# Altium project ESP32_IO_module.PrjPcb
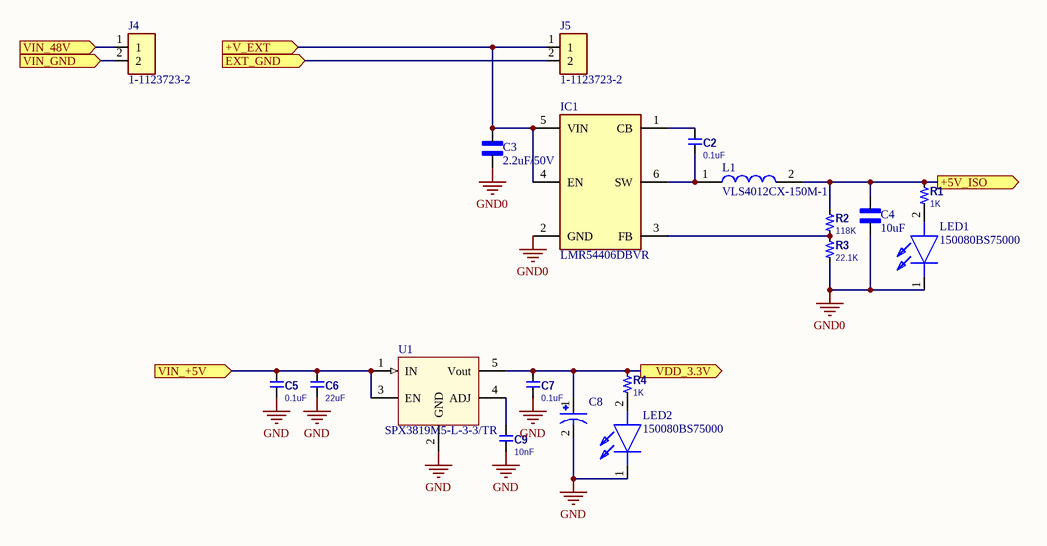
[diagram p0: Power_management.SchDoc]
6 sheets, 149 parts. Net scope: flat (ports and power ports of the same name join across sheets).
Board file: PCB1.PcbDoc
Sheets:
  Power_management.SchDoc
  MCU.SchDoc
  DIGITAL_INPUT.SchDoc
  ANALOG_INPUT.SchDoc
  DIGITAL_OUTPUT.SchDoc
  RFID.SchDoc

## Sheet Power_management.SchDoc
size A

### Parts
C2  0.1uF  [0603-C]
C3  2.2uF/50V  [0805_C]
C4  10uF  [0805_C]
C5  0.1uF  [0603-C]
C6  22uF  [0603-C]
C7  0.1uF  [0603-C]
C8  T493X227K010BH6420_220uF  [CAPPM7343X430N]  (value not drawn)
C9  10nF  [0603-C]
IC1  LMR54406DBVR  [SOT95P280X145-6N]
J4  1-1123723-2  [TE_1-1123723-2]
J5  1-1123723-2  [TE_1-1123723-2]
L1  VLS4012CX-150M-1  [VLS4012]
LED1  150080BS75000  [LEDC2012X80N]
LED2  150080BS75000  [LEDC2012X80N]
R1  1K  [0603-R]
R2  118K  [0603-R]
R3  22.1K  [0603-R]
R4  1K  [0603-R]
U1  SPX3819M5-L-3-3/TR  [SOT23-5]

### Ports
+5V_ISO (out), +V_EXT (in), EXT_GND (in), VDD_3.3V (out), VIN_48V (in), VIN_+5V (in), VIN_GND (in)

### Nets
GND: C5.2 C6.2 C7.2 C8.2 C9.2 LED2.1(K) U1.2(GND)
GND0: C3.2 C4.2 IC1.2(GND) LED1.1(K) R3.1
NetC2_1: C2.1 IC1.1(CB)
NetC2_2: C2.2 IC1.6(SW) L1.1
NetC3_1: C3.1 IC1.4(EN) IC1.5(VIN) J5.1 ; port +V_EXT
NetC4_1: C4.1 L1.2 R1.2 R2.2 ; port +5V_ISO
NetC5_1: C5.1 C6.1 U1.1(IN) U1.3(EN) ; port VIN_+5V
NetC7_1: C7.1 C8.1 R4.2 U1.5(Vout) ; port VDD_3.3V
NetC9_1: C9.1 U1.4(ADJ)
NetIC1_3: IC1.3(FB) R2.1 R3.2
NetJ4_1: J4.1 ; port VIN_48V
NetJ4_2: J4.2 ; port VIN_GND
NetJ5_2: J5.2 ; port EXT_GND
NetLED1_2: LED1.2(A) R1.1
NetLED2_2: LED2.2(A) R4.1

### Library data of the parts
C2 C5-C7 C9 = CAP: Manufacturer: TDK EPCOS; Manufacturer Part Number: B37941K9105K62; Capacitance: 1uF; Voltage Rating: 16V; Tolerance: 10%; ComponentLink1URL: https://datasheet.ciiva.com/13389/upy-gphc-y5v-6-3v-to-50v-5-13389978.pdf?src-supplier=Mouser; ComponentLink1Description: Datasheet; Supplier 1: Digi-Key; RoHS: Yes; Category: Ceramic Capacitors; Mount: Surface Mount; Case/Package: 0805; Case Code (Metric): 2012; Case Code (Imperial): 0805; Min Operating Temperature: -55°C; Max Operating Temperature: 125°C; Package Quantity: 3000; Packaging: Tape and Reel; Voltage Rating (DC): 16V; Length: 0.079inch; Width: 0.049inch; Height: 1.35mm; Thickness: 0.049inch; Ratings: AEC-Q200; Lead Free: Lead Free; ComponentLink2URL: http://components.arrow.com/part/dataview/0323_01879911?src-supplier=Arrow+Europe; ComponentLink2Description: http://components.arrow.com/part/dataview/0323_01879911?src-supplier=Arrow+Europe; ComponentLink3URL: https://media.digikey.com/pdf/Data%20Sheets/Epcos%20PDFs/B37872K_B37941K_Series.pdf?src-supplier=Digi-Key; ComponentLink3Description: https://media.digikey.com/pdf/Data%20Sheets/Epcos%20PDFs/B37872K_B37941K_Series.pdf?src-supplier=Digi-Key; Supplier Part Number 1: 495-1935-1-ND
C3 C4 = CAP: MP: LD03ZD475MAB2A; Package: None; Price: None; Value: *; Availability: Unavailable
C8 = T493X227K010BH6420_220uF: MF: Kemet; Value: *; MP: T493X227K010BH6420; Package: SMD-2 Kemet; Availability: In Stock; Check_prices: https://www.snapeda.com/parts/T493X227K010BH6420/Kemet/view-part/?ref=eda; SnapEDA_Link: https://www.snapeda.com/parts/T493X227K010BH6420/Kemet/view-part/?ref=snap; Price: None
IC1 = LMR54406DBVR: Integrated Circuit; Manufacturer_Name: Texas Instruments; Datasheet Link: https://www.ti.com/lit/ds/symlink/lmr54406.pdf?ts=1659688249350&ref_url=https%253A%252F%252Fwww.ti.com%252Fproduct%252FLMR54406%252Fpart-details%252FLMR54406DBVR; Height: 1.45mm; Manufacturer_Part_Number: LMR54406DBVR; Mouser Part Number: 595-LMR54406DBVR; Mouser Price/Stock: https://www.mouser.co.uk/ProductDetail/Texas-Instruments/LMR54406DBVR?qs=rSMjJ%252B1ewcQLNU8KVBwgHQ%3D%3D; Arrow Part Number: LMR54406DBVR; Arrow Price/Stock: https://www.arrow.com/en/products/lmr54406dbvr/texas-instruments?region=nac
J4 J5 = 1-1123723-2: 3.96 EP HDR ASSY 2P_NATURAL_; Number_of_Positions: 2; MF: TE Connectivity; Product_Type: Header; Centerline_Pitch: 3.96 mm[.156 in]; EU_RoHS_Compliance: Compliant; Value: *; TE_purchase_URL: https://www.te.com/usa-en/product-1-1123723-2.html?te_bu=Cor&te_type=disp&te_campaign=seda_glo_cor-seda-global-disp-prtnr-fy19-seda-model-bom-cta_sma-317_1&elqCampaignId=32493; SnapEDA_Link: https://www.snapeda.com/parts/1-1123723-2/TE%20Connectivity%20AMP%20Connectors/view-part/231687/?ref=snap; Package: None; MP: 1-1123723-2; Digi-Key_Purchase_URL: https://www.digikey.com/product-detail/en/te-connectivity-amp-connectors/1-1123723-2/A111830-ND/686925?utm_source=snapeda&utm_medium=aggregator&utm_campaign=symbol; Digi-Key_Part_Number: A111830-ND
L1 = VLS4012CX-150M-1: Inductor; Manufacturer_Name: TDK; Datasheet Link: https://product.tdk.com/system/files/dam/doc/product/inductor/inductor/smd/catalog/inductor_commercial_power_vls4012cx-1_en.pdf; Manufacturer_Part_Number: VLS4012CX-150M-1; Mouser Part Number: 810-VLS4012CX150M1; Mouser Price/Stock: https://www.mouser.co.uk/ProductDetail/TDK/VLS4012CX-150M-1?qs=sPbYRqrBIVl6JuB3PiTP7w%3D%3D
LED1 LED2 = 150080BS75000: LED; Manufacturer_Name: Wurth Elektronik; Datasheet Link: https://katalog.we-online.com/led/datasheet/150080BS75000.pdf; Height: 0.8mm; Manufacturer_Part_Number: 150080BS75000; Mouser Part Number: 710-150080BS75000; Mouser Price/Stock: https://www.mouser.co.uk/ProductDetail/Wurth-Elektronik/150080BS75000?qs=2kOmHSv6VfT2tBo3UPVqAQ%3D%3D
R1-R4 = Res_2: Manufacturer: Panasonic; Manufacturer Part Number: ERJ-8GEYJ621V; Resistance: 620R; Tolerance: 5%; Voltage Rating: 200V; Temperature Coefficient: 200ppm/°C; Max Power Dissipation: 250mW; ComponentLink1URL: https://datasheet.ciiva.com/15193/getdatasheetpartid-366470-15193725.pdf?src-supplier=Verical; ComponentLink1Description: Datasheet; Supplier 1: Avnet; Stock 1: 6255; Pricing 1: 1 = 0.01200 (USD); RoHS: Yes; Mount: Surface Mount; Case Code (Metric): 3216; Case Code (Imperial): 1206; Contact Plating: Tin; Min Operating Temperature: -55°C; Max Operating Temperature: 155°C; Packaging: Tape and Reel; Package Quantity: 1; Resistor Type: Thick Film; Number of Terminations: 2; Voltage Rating (DC): 200V; Features: Automotive AEC-Q200; Series: ERJ; Construction: Rectangular; Resistance Tolerance: 5%; Length: 3.2mm; Width: 0.063inch; Height: 0.028inch; Depth: 1.6mm; Radiation Hardening: No; REACH SVHC: No SVHC; Military Standard: Not; Lead Free: Lead Free; RoHS Compliant: Yes; ComponentLink2URL: https://datasheet.ciiva.com/46387/1500035-46387094.pdf?src-supplier=Element14; ComponentLink2Description: https://datasheet.ciiva.com/46387/1500035-46387094.pdf?src-supplier=Element14; ComponentLink3URL: https://datasheet.ciiva.com/5915/1500035-5915369.pdf?src-supplier=Farnell; ComponentLink3Description: https://datasheet.ciiva.com/5915/1500035-5915369.pdf?src-supplier=Farnell; ComponentLink4URL: https://datasheet.ciiva.com/28677/1678796-28677018.pdf?src-supplier=Element14; ComponentLink4Description: https://datasheet.ciiva.com/28677/1678796-28677018.pdf?src-supplier=Element14; ComponentLink5URL: https://datasheet.ciiva.com/17204/aoa0000ce1-17204972.pdf?src-supplier=Avnet+Europe; ComponentLink5Description: https://datasheet.ciiva.com/17204/aoa0000ce1-17204972.pdf?src-supplier=Avnet+Europe; ComponentLink6URL: https://datasheet.ciiva.com/16515/aoa0000ce1-16515933.pdf?src-supplier=Avnet+Asia; ComponentLink6Description: https://datasheet.ciiva.com/16515/aoa0000ce1-16515933.pdf?src-supplier=Avnet+Asia; Supplier Part Number 1: 65T8955; Power Rating: 250mW; Case/Package: 0603
U1 = SPX3819: Linear Voltage Regulator IC 1 Output 500mA SOT-23-5; MF: MaxLinear, Inc.; SnapEDA_Link: https://www.snapeda.com/parts/SPX3819/MaxLinear,%20Inc./view-part/885098/?ref=snap; Package: SOT-23-5 MaxLinear, Inc.; Availability: Unavailable; Price: None; MP: SPX3819; Value: *

## Sheet MCU.SchDoc: MCU
size A3; DocumentNumber: MB1136; Revision: C.3; SheetNumber: 2; SheetTotal: 4; Project: NUCLEO-XXXXRX
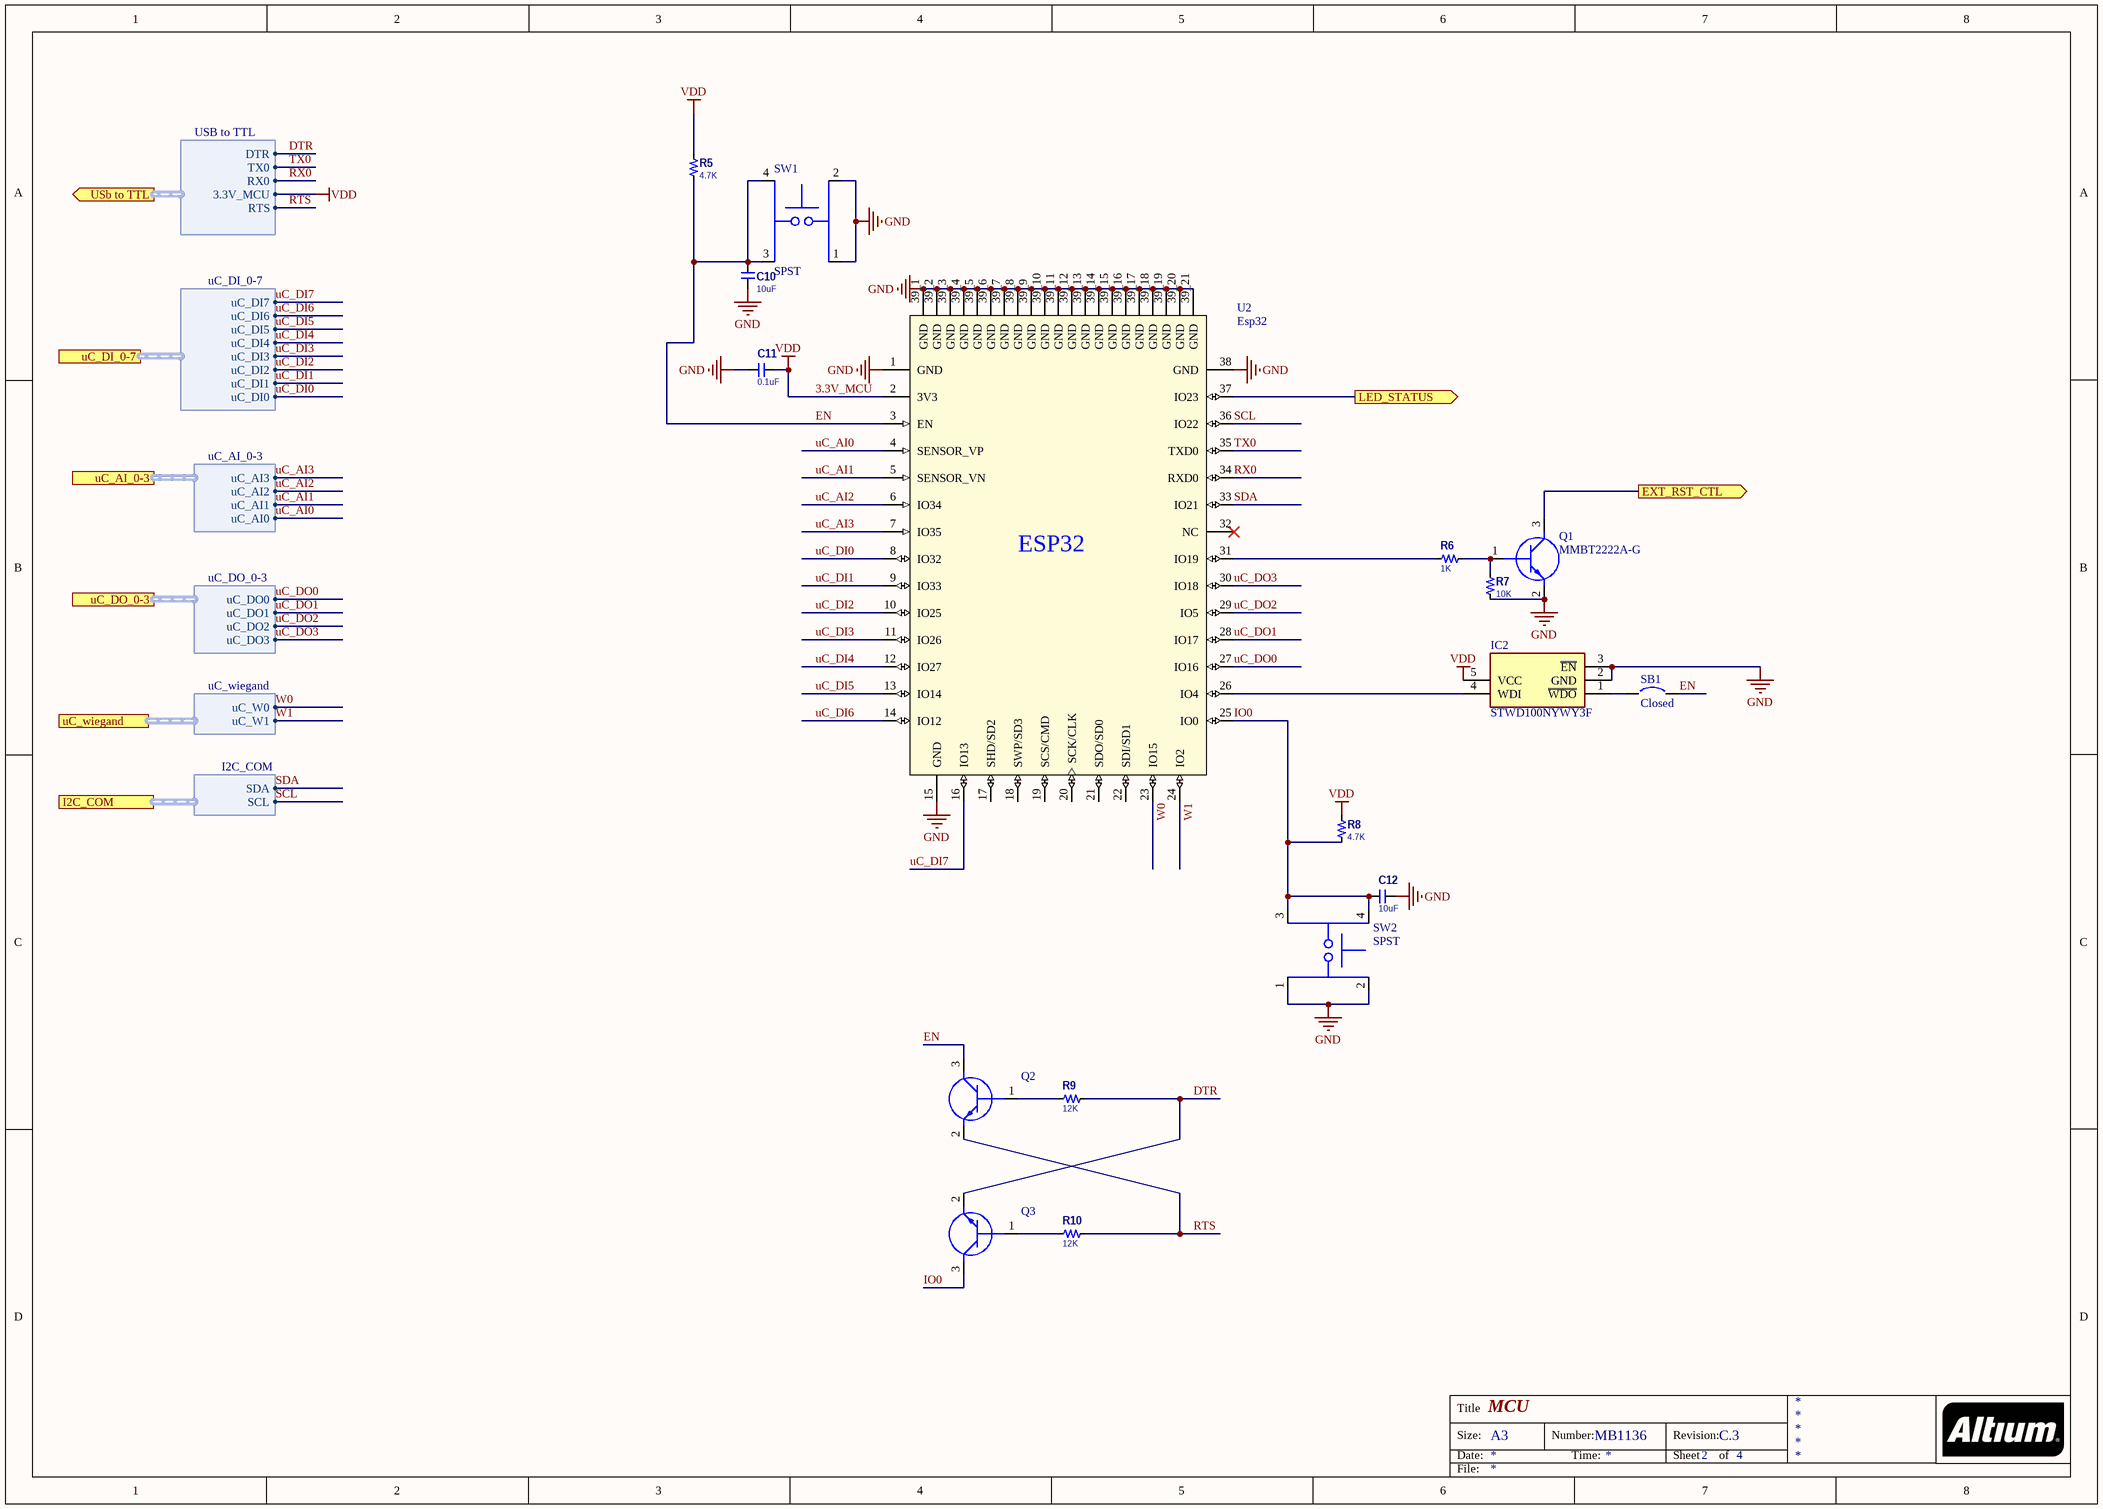
[diagram p1: MCU.SchDoc]

### Parts
C10  10uF  [0603-C]
C11  0.1uF  [0603-C]
C12  10uF  [0603-C]
IC2  STWD100NYWY3F  [SOT95P280X145-5N]
Q1  MMBT2222A-G  [SOT95P240X115-3N]
Q2  MMBT2222A-G  [SOT95P240X115-3N]  (value not drawn)
Q3  MMBT2222A-G  [SOT95P240X115-3N]  (value not drawn)
R5  4.7K  [0603-R]
R6  1K  [0603-R]
R7  10K  [0603-R]
R8  4.7K  [0603-R]
R9  12K  [0603-R]
R10  12K  [0603-R]
SB1  Closed  [SB_0603]
SW1  SPST  [TL3342F160QG]
SW2  SPST  [TL3342F160QG]
U2  Esp32  [MODULE_ESP32-WROOM-32]

### Ports
EXT_RST_CTL (out), I2C_COM (harness I2C_COM), LED_STATUS (out), uC_AI_0-3 (harness uC_AI_0-3), uC_DI_0-7 (harness uC_DI_0-7), uC_DO_0-3 (harness uC_DO_0-3), uC_wiegand (harness uC_wiegand), USb to TTL (out, harness USB to TTL)

### Harnesses
USB to TTL: TX0, RX0, DTR, RTS, 3.3V_MCU
uC_DI_0-7: uC_DI0, uC_DI1, uC_DI2, uC_DI3, uC_DI4, uC_DI5, uC_DI6, uC_DI7
uC_AI_0-3: uC_AI0, uC_AI1, uC_AI2, uC_AI3
uC_DO_0-3: uC_DO0, uC_DO1, uC_DO2, uC_DO3
uC_wiegand: uC_W0, uC_W1
I2C_COM: SDA, SCL

### Nets
3.3V_MCU: C11.2 IC2.5(VCC) R5.2 R8.2 U2.2(3V3) ; port USb to TTL.3.3V_MCU  [also labelled VDD]
GND: C10.2 C11.1 C12.2 IC2.2(GND) IC2.3(~{EN}) Q1.2(E) R7.1 SW1.1 SW1.2 SW2.1 SW2.2 U2.1(GND) U2.15(GND) U2.38(GND) U2.39_1(GND) U2.39_2(GND) U2.39_3(GND) U2.39_4(GND) U2.39_5(GND) U2.39_6(GND) U2.39_7(GND) U2.39_8(GND) U2.39_9(GND) U2.39_10(GND) U2.39_11(GND) U2.39_12(GND) U2.39_13(GND) U2.39_14(GND) U2.39_15(GND) U2.39_16(GND) U2.39_17(GND) U2.39_18(GND) U2.39_19(GND) U2.39_20(GND) U2.39_21(GND)
DTR: Q3.2(E) R9.1 ; port USb to TTL.DTR
EN: C10.1 Q2.3(C) R5.1 SB1.2 SW1.3 SW1.4 U2.3(EN)
IO0: C12.1 Q3.3(C) R8.1 SW2.3 SW2.4 U2.25(IO0)
RTS: Q2.2(E) R10.1 ; port USb to TTL.RTS
RX0: U2.34(RXD0) ; port USb to TTL.RX0
SCL: U2.36(IO22) ; port I2C_COM.SCL
SDA: U2.33(IO21) ; port I2C_COM.SDA
TX0: U2.35(TXD0) ; port USb to TTL.TX0
uC_AI0: U2.4(SENSOR_VP) ; port uC_AI_0-3.uC_AI0
uC_AI1: U2.5(SENSOR_VN) ; port uC_AI_0-3.uC_AI1
uC_AI2: U2.6(IO34) ; port uC_AI_0-3.uC_AI2
uC_AI3: U2.7(IO35) ; port uC_AI_0-3.uC_AI3
uC_DI0: U2.8(IO32) ; port uC_DI_0-7.uC_DI0
uC_DI1: U2.9(IO33) ; port uC_DI_0-7.uC_DI1
uC_DI2: U2.10(IO25) ; port uC_DI_0-7.uC_DI2
uC_DI3: U2.11(IO26) ; port uC_DI_0-7.uC_DI3
uC_DI4: U2.12(IO27) ; port uC_DI_0-7.uC_DI4
uC_DI5: U2.13(IO14) ; port uC_DI_0-7.uC_DI5
uC_DI6: U2.14(IO12) ; port uC_DI_0-7.uC_DI6
uC_DI7: U2.16(IO13) ; port uC_DI_0-7.uC_DI7
uC_DO0: U2.27(IO16) ; port uC_DO_0-3.uC_DO0
uC_DO1: U2.28(IO17) ; port uC_DO_0-3.uC_DO1
uC_DO2: U2.29(IO5) ; port uC_DO_0-3.uC_DO2
uC_DO3: U2.30(IO18) ; port uC_DO_0-3.uC_DO3
W0: U2.23(IO15) ; port uC_wiegand.uC_W0
W1: U2.24(IO2) ; port uC_wiegand.uC_W1
NetIC2_1: IC2.1(~{WDO}) SB1.1
NetIC2_4: IC2.4(WDI) U2.26(IO4)
NetQ1_1: Q1.1(B) R6.1 R7.2
NetQ1_3: Q1.3(C) ; port EXT_RST_CTL
NetQ2_1: Q2.1(B) R9.2
NetQ3_1: Q3.1(B) R10.2
NetR6_2: R6.2 U2.31(IO19)
NetU2_37: U2.37(IO23) ; port LED_STATUS

Not connected (* = marked no-connect by the designer): U2 17(SHD/SD2) 18(SWP/SD3) 19(SCS/CMD) 20(SCK/CLK) 21(SDO/SD0) 22(SDI/SD1) 32(NC)*

### Notes on the sheet
- Title
- Size:
- Date:
- A3
- Number:
- Time:
- Revision:
- Sheet
- of
- File:
- (in symbol ESP32-WROOM-32) ESP32

### Library data of the parts
C10-C12 = CAP: as C2 on sheet Power_management; ComponentLink1URL: https://datasheet.ciiva.com/13389/upy-gphc-y5v-6-3v-to-50v-5-13389978.pdf?src-supplier=Mouser; ComponentLink1Description: Datasheet; Supplier 1: Digi-Key; RoHS: Yes; Category: Ceramic Capacitors; Mount: Surface Mount; Case/Package: 0805; Case Code (Metric): 2012; Case Code (Imperial): 0805; Min Operating Temperature: -55°C; Max Operating Temperature: 125°C; Package Quantity: 3000; Packaging: Tape and Reel; Voltage Rating (DC): 16V; Length: 0.079inch; Width: 0.049inch; Height: 1.35mm; Thickness: 0.049inch; Ratings: AEC-Q200; Lead Free: Lead Free; ComponentLink2URL: http://components.arrow.com/part/dataview/0323_01879911?src-supplier=Arrow+Europe; ComponentLink2Description: http://components.arrow.com/part/dataview/0323_01879911?src-supplier=Arrow+Europe; ComponentLink3URL: https://media.digikey.com/pdf/Data%20Sheets/Epcos%20PDFs/B37872K_B37941K_Series.pdf?src-supplier=Digi-Key; ComponentLink3Description: https://media.digikey.com/pdf/Data%20Sheets/Epcos%20PDFs/B37872K_B37941K_Series.pdf?src-supplier=Digi-Key; Supplier Part Number 1: 495-1935-1-ND
IC2 = STWD100NYWY3F: Integrated Circuit; Manufacturer_Name: STMicroelectronics; Datasheet Link: https://datasheet.datasheetarchive.com/originals/distributors/Datasheets-DGA25/1683135.pdf; Height: 1.45mm; Manufacturer_Part_Number: STWD100NYWY3F; Mouser Part Number: 511-STWD100NYWY3F; Mouser Price/Stock: https://www.mouser.co.uk/ProductDetail/STMicroelectronics/STWD100NYWY3F?qs=jWm4idrLpzx15dHtESXwMQ%3D%3D; Arrow Part Number: STWD100NYWY3F; Arrow Price/Stock: https://www.arrow.com/en/products/stwd100nywy3f/stmicroelectronics?region=europe
Q1 Q3 = MMBT2222A-G: Transistor BJT NPN; Manufacturer_Name: Comchip Technology; Height: 1.15mm; Manufacturer_Part_Number: MMBT2222A-G; Mouser Part Number: 750-MMBT2222A-G; Mouser Price/Stock: https://www.mouser.co.uk/ProductDetail/Comchip-Technology/MMBT2222A-G?qs=2qJf6qQ4IOIM%2FSE9iCL8gQ%3D%3D; Arrow Part Number: MMBT2222A-G
  Q1: Datasheet Link: https://datasheet.datasheetarchive.com/originals/distributors/Datasheets-7/DSA-138996.pdf; Arrow Price/Stock: https://www.arrow.com/en/products/mmbt2222a-g/comchip-technology?region=nac
  Q3: Datasheet Link: http://www.comchiptech.com/admin/files/product/MMBT2222A-G%20RevB.pdf; Arrow Price/Stock: https://www.arrow.com/en/products/mmbt2222a-g/comchip-technology
Q2 = MMBT2222A-G_Mirror: Transistor BJT NPN; Manufacturer_Name: Comchip Technology; Datasheet Link: http://www.comchiptech.com/admin/files/product/MMBT2222A-G%20RevB.pdf; Height: 1.15mm; Manufacturer_Part_Number: MMBT2222A-G; Mouser Part Number: 750-MMBT2222A-G; Mouser Price/Stock: https://www.mouser.co.uk/ProductDetail/Comchip-Technology/MMBT2222A-G?qs=2qJf6qQ4IOIM%2FSE9iCL8gQ%3D%3D; Arrow Part Number: MMBT2222A-G; Arrow Price/Stock: https://www.arrow.com/en/products/mmbt2222a-g/comchip-technology
R5-R10 = Res_2: as R1 on sheet Power_management; ComponentLink1URL: https://datasheet.ciiva.com/15193/getdatasheetpartid-366470-15193725.pdf?src-supplier=Verical; ComponentLink1Description: Datasheet; Supplier 1: Avnet; Stock 1: 6255; Pricing 1: 1 = 0.01200 (USD); RoHS: Yes; Mount: Surface Mount; Case Code (Metric): 3216; Case Code (Imperial): 1206; Contact Plating: Tin; Min Operating Temperature: -55°C; Max Operating Temperature: 155°C; Packaging: Tape and Reel; Package Quantity: 1; Resistor Type: Thick Film; Number of Terminations: 2; Voltage Rating (DC): 200V; Features: Automotive AEC-Q200; Series: ERJ; Construction: Rectangular; Resistance Tolerance: 5%; Length: 3.2mm; Width: 0.063inch; Height: 0.028inch; Depth: 1.6mm; Radiation Hardening: No; REACH SVHC: No SVHC; Military Standard: Not; Lead Free: Lead Free; RoHS Compliant: Yes; ComponentLink2URL: https://datasheet.ciiva.com/46387/1500035-46387094.pdf?src-supplier=Element14; ComponentLink2Description: https://datasheet.ciiva.com/46387/1500035-46387094.pdf?src-supplier=Element14; ComponentLink3URL: https://datasheet.ciiva.com/5915/1500035-5915369.pdf?src-supplier=Farnell; ComponentLink3Description: https://datasheet.ciiva.com/5915/1500035-5915369.pdf?src-supplier=Farnell; ComponentLink4URL: https://datasheet.ciiva.com/28677/1678796-28677018.pdf?src-supplier=Element14; ComponentLink4Description: https://datasheet.ciiva.com/28677/1678796-28677018.pdf?src-supplier=Element14; ComponentLink5URL: https://datasheet.ciiva.com/17204/aoa0000ce1-17204972.pdf?src-supplier=Avnet+Europe; ComponentLink5Description: https://datasheet.ciiva.com/17204/aoa0000ce1-17204972.pdf?src-supplier=Avnet+Europe; ComponentLink6URL: https://datasheet.ciiva.com/16515/aoa0000ce1-16515933.pdf?src-supplier=Avnet+Asia; ComponentLink6Description: https://datasheet.ciiva.com/16515/aoa0000ce1-16515933.pdf?src-supplier=Avnet+Asia; Supplier Part Number 1: 65T8955; Power Rating: 250mW; Case/Package: 0603
SB1 = Circuit Breaker_close: Circuit Breaker; Published: 24-Mar-1999; Revision: July-2002: Re-released for DXP Platform.; Publisher: Altium Limited
SW1 SW2 = SWITCH TACTILE SPST-NO 0.05A 12V_EWP: E-SWITCH - TL3342F160QG - SWITCH, TACTILE, SPST-NO, 50mA, 12VDC; Manufacturer: SOFNG; Manufacturer Part Number: TS-1187-1816; Actuator Material: Polyphenylene; Mechanical Life: 100000Cycles; Switch Function: Off-Mom; Actuator Type: Standard; Illumination Type: Non-Illuminated; Operating Force: 160gf; Voltage Rating (DC): 12V; Actuator Length: 0.3mm; Supplier 1: Digi-Key; RoHS: Yes; Category: Tactile Switches; Stock 1: 9379; Pricing 1: 1=0.66000, 10=0.63500, 25=0.61120, 100=0.53040, 250=0.48396, 500=0.44974, 1000=0.40329 (USD); Mount: Surface Mount; Contact Plating: Silver; Contact Material: Silver; Throw Configuration: SPST; Packaging: Tape and Reel; Termination: Gull Wing; Current Rating: 50mA; Package Quantity: 3000; Series: TL3342; Orientation: Straight; Electrical Life: 100000Cycles; Max Voltage Rating (DC): 12V; Size: 5.2mm; RoHS Compliant: Yes; ComponentLink1URL: https://datasheet.lcsc.com/lcsc/1809012111_SOFNG-TS-1187-1816_C183614.pdf; ComponentLink1Description: https://datasheet.ciiva.com/2900/tl3342-2900822.pdf?src-supplier=Digi-Key; Supplier Part Number 1: EG2531CT-ND
U2 = ESP32-WROOM-32: Bluetooth, WiFi Transceiver Module 2.4GHz ~ 2.5GHz Surface Mount; MF: Espressif Systems; Package: Module Espressif Systems; Digi-Key_Part_Number: 1904-1010-1-ND; Digi-Key_Purchase_URL: https://www.digikey.com/product-detail/en/espressif-systems/ESP32-WROOM-32/1904-1010-1-ND/8544305?utm_source=snapeda&utm_medium=aggregator&utm_campaign=symbol; Value: *; MP: ESP32-WROOM-32; SnapEDA_Link: https://www.snapeda.com/parts/ESP32-WROOM-32/Espressif%20Systems/view-part/2753322/?ref=snap

## Sheet DIGITAL_INPUT.SchDoc
size A
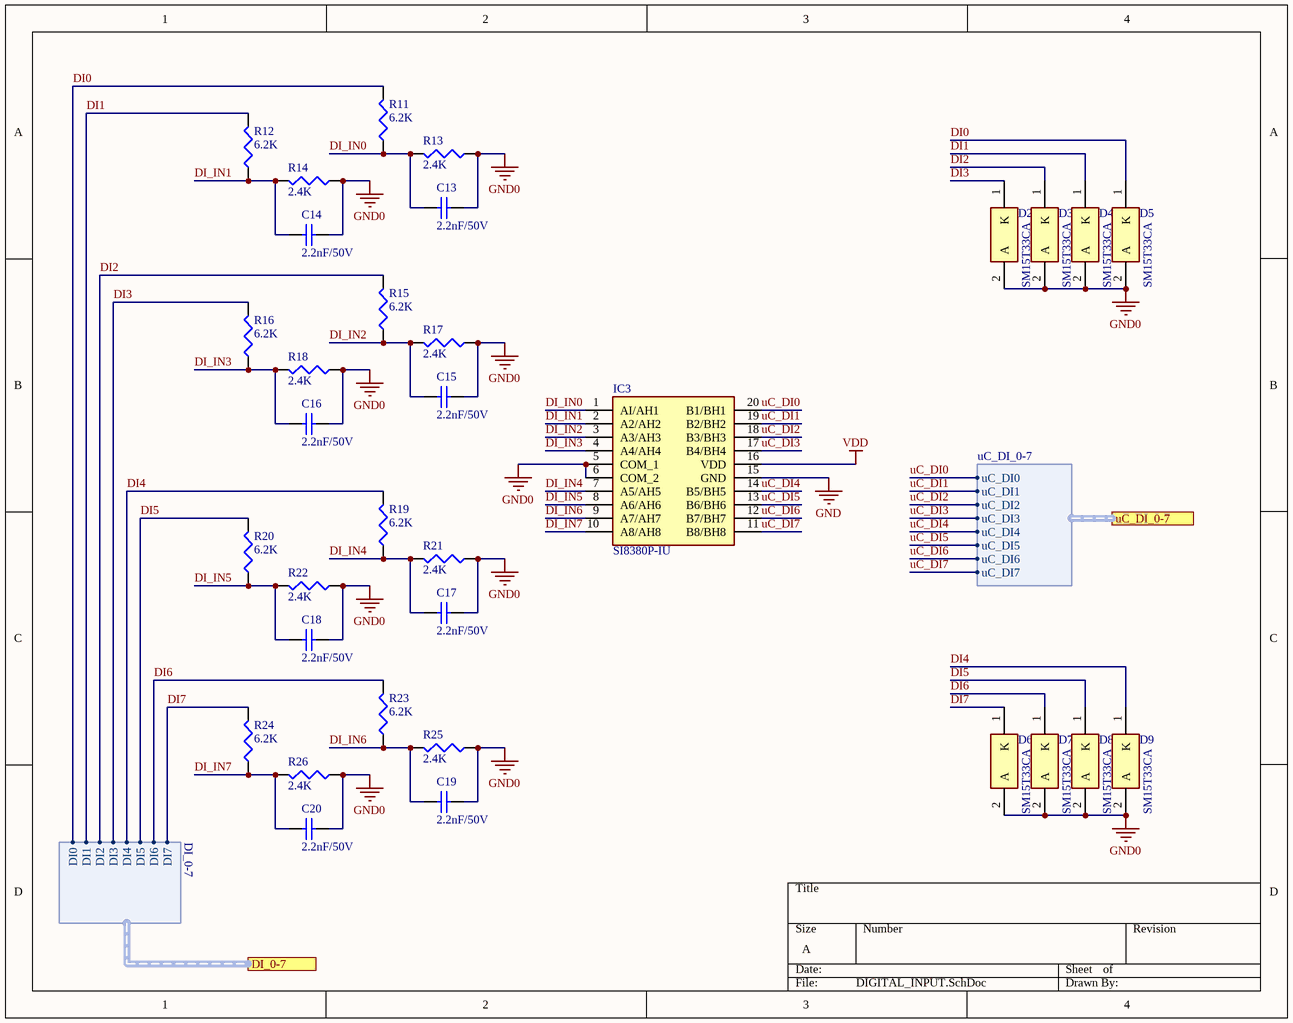
[diagram p2: DIGITAL_INPUT.SchDoc]

### Parts
C13  2.2nF/50V  [C1210]
C14  2.2nF/50V  [C1210]
C15  2.2nF/50V  [C1210]
C16  2.2nF/50V  [C1210]
C17  2.2nF/50V  [C1210]
C18  2.2nF/50V  [C1210]
C19  2.2nF/50V  [C1210]
C20  2.2nF/50V  [C1210]
D2  SM15T33CA  [DIONM8059X265N]
D3  SM15T33CA  [DIONM8059X265N]
D4  SM15T33CA  [DIONM8059X265N]
D5  SM15T33CA  [DIONM8059X265N]
D6  SM15T33CA  [DIONM8059X265N]
D7  SM15T33CA  [DIONM8059X265N]
D8  SM15T33CA  [DIONM8059X265N]
D9  SM15T33CA  [DIONM8059X265N]
IC3  SI8380P-IU  [SOP64P600X175-20N]
R11  6.2K  [12Z-2010]
R12  6.2K  [12Z-2010]
R13  2.4K  [12Z-2010]
R14  2.4K  [12Z-2010]
R15  6.2K  [12Z-2010]
R16  6.2K  [12Z-2010]
R17  2.4K  [12Z-2010]
R18  2.4K  [12Z-2010]
R19  6.2K  [12Z-2010]
R20  6.2K  [12Z-2010]
R21  2.4K  [12Z-2010]
R22  2.4K  [12Z-2010]
R23  6.2K  [12Z-2010]
R24  6.2K  [12Z-2010]
R25  2.4K  [12Z-2010]
R26  2.4K  [12Z-2010]

### Ports
DI_0-7 (harness DI_0-7), uC_DI_0-7 (harness uC_DI_0-7)

### Harnesses
DI_0-7: DI0, DI1, DI2, DI3, DI4, DI5, DI6, DI7
uC_DI_0-7: uC_DI0, uC_DI1, uC_DI2, uC_DI3, uC_DI4, uC_DI5, uC_DI6, uC_DI7

### Nets
GND: IC3.15(GND)
GND0: C13.2 C14.2 C15.2 C16.2 C17.2 C18.2 C19.2 C20.2 D2.2(A) D3.2(A) D4.2(A) D5.2(A) D6.2(A) D7.2(A) D8.2(A) D9.2(A) IC3.5(COM_1) IC3.6(COM_2) R13.1 R14.1 R17.1 R18.1 R21.1 R22.1 R25.1 R26.1
VDD: IC3.16(VDD)  [project net 3.3V_MCU]
DI0: D5.1(K) R11.2 ; port DI_0-7.DI0
DI1: D4.1(K) R12.2 ; port DI_0-7.DI1
DI2: D3.1(K) R15.2 ; port DI_0-7.DI2
DI3: D2.1(K) R16.2 ; port DI_0-7.DI3
DI4: D9.1(K) R19.2 ; port DI_0-7.DI4
DI5: D8.1(K) R20.2 ; port DI_0-7.DI5
DI6: D7.1(K) R23.2 ; port DI_0-7.DI6
DI7: D6.1(K) R24.2 ; port DI_0-7.DI7
DI_IN0: C13.1 IC3.1(AI/AH1) R11.1 R13.2
DI_IN1: C14.1 IC3.2(A2/AH2) R12.1 R14.2
DI_IN2: C15.1 IC3.3(A3/AH3) R15.1 R17.2
DI_IN3: C16.1 IC3.4(A4/AH4) R16.1 R18.2
DI_IN4: C17.1 IC3.7(A5/AH5) R19.1 R21.2
DI_IN5: C18.1 IC3.8(A6/AH6) R20.1 R22.2
DI_IN6: C19.1 IC3.9(A7/AH7) R23.1 R25.2
DI_IN7: C20.1 IC3.10(A8/AH8) R24.1 R26.2
uC_DI0: IC3.20(B1/BH1) ; port uC_DI_0-7.uC_DI0
uC_DI1: IC3.19(B2/BH2) ; port uC_DI_0-7.uC_DI1
uC_DI2: IC3.18(B3/BH3) ; port uC_DI_0-7.uC_DI2
uC_DI3: IC3.17(B4/BH4) ; port uC_DI_0-7.uC_DI3
uC_DI4: IC3.14(B5/BH5) ; port uC_DI_0-7.uC_DI4
uC_DI5: IC3.13(B6/BH6) ; port uC_DI_0-7.uC_DI5
uC_DI6: IC3.12(B7/BH7) ; port uC_DI_0-7.uC_DI6
uC_DI7: IC3.11(B8/BH8) ; port uC_DI_0-7.uC_DI7

### Library data of the parts
C13-C20 = Cap Semi: Capacitor (Semiconductor SIM Model); Published: 8-Jun-2000; LatestRevisionDate: 29-May-2009; LatestRevisionNote: IPC-7351 Footprint Added.; PackageReference: C1206; Publisher: Altium Limited; PackageDescription: Chip Capacitor; Value: 2.2nF/50V
D2-D9 = SM15T33CA: Diode; Manufacturer_Name: STMicroelectronics; Allied_Number: 70390412; Datasheet Link: http://www.st.com/web/en/resource/technical/document/datasheet/CD00000724.pdf; Height: 2.65mm; Manufacturer_Part_Number: SM15T33CA; Mouser Part Number: 511-SM15T33CA; Mouser Price/Stock: https://www.mouser.com/Search/Refine.aspx?Keyword=511-SM15T33CA; RS Part Number: 9196428; RS Price/Stock: https://uk.rs-online.com/web/p/products/9196428; Allied Price/Stock: http://www.alliedelec.com/stmicroelectronics-sm15t33ca/70390412/
IC3 = SI8380P-IU: Integrated Circuit; Manufacturer_Name: Silicon Labs; Datasheet Link: https://componentsearchengine.com/Datasheets/1/SI8380P-IU.pdf; Height: 1.75mm; Mouser Part Number: 634-SI8380P-IU; Mouser Price/Stock: https://www.mouser.com/Search/Refine.aspx?Keyword=634-SI8380P-IU; Manufacturer_Part_Number: SI8380P-IU
R11-R26 = Res3: Resistor; Published: 8-Jun-2000; LatestRevisionDate: 29-May-2009; LatestRevisionNote: IPC-7351 Footprint Added.; PackageReference: J1-0603; Publisher: Altium Limited; PackageDescription: Chip Resistor
  R11 R12 R15 R16 R19 R23 R24: Value: 6.2K
  R13 R14 R17 R18 R21 R22 R25 R26: Value: 2.4K
  R20: Value: 6.2k

## Sheet ANALOG_INPUT.SchDoc
size C
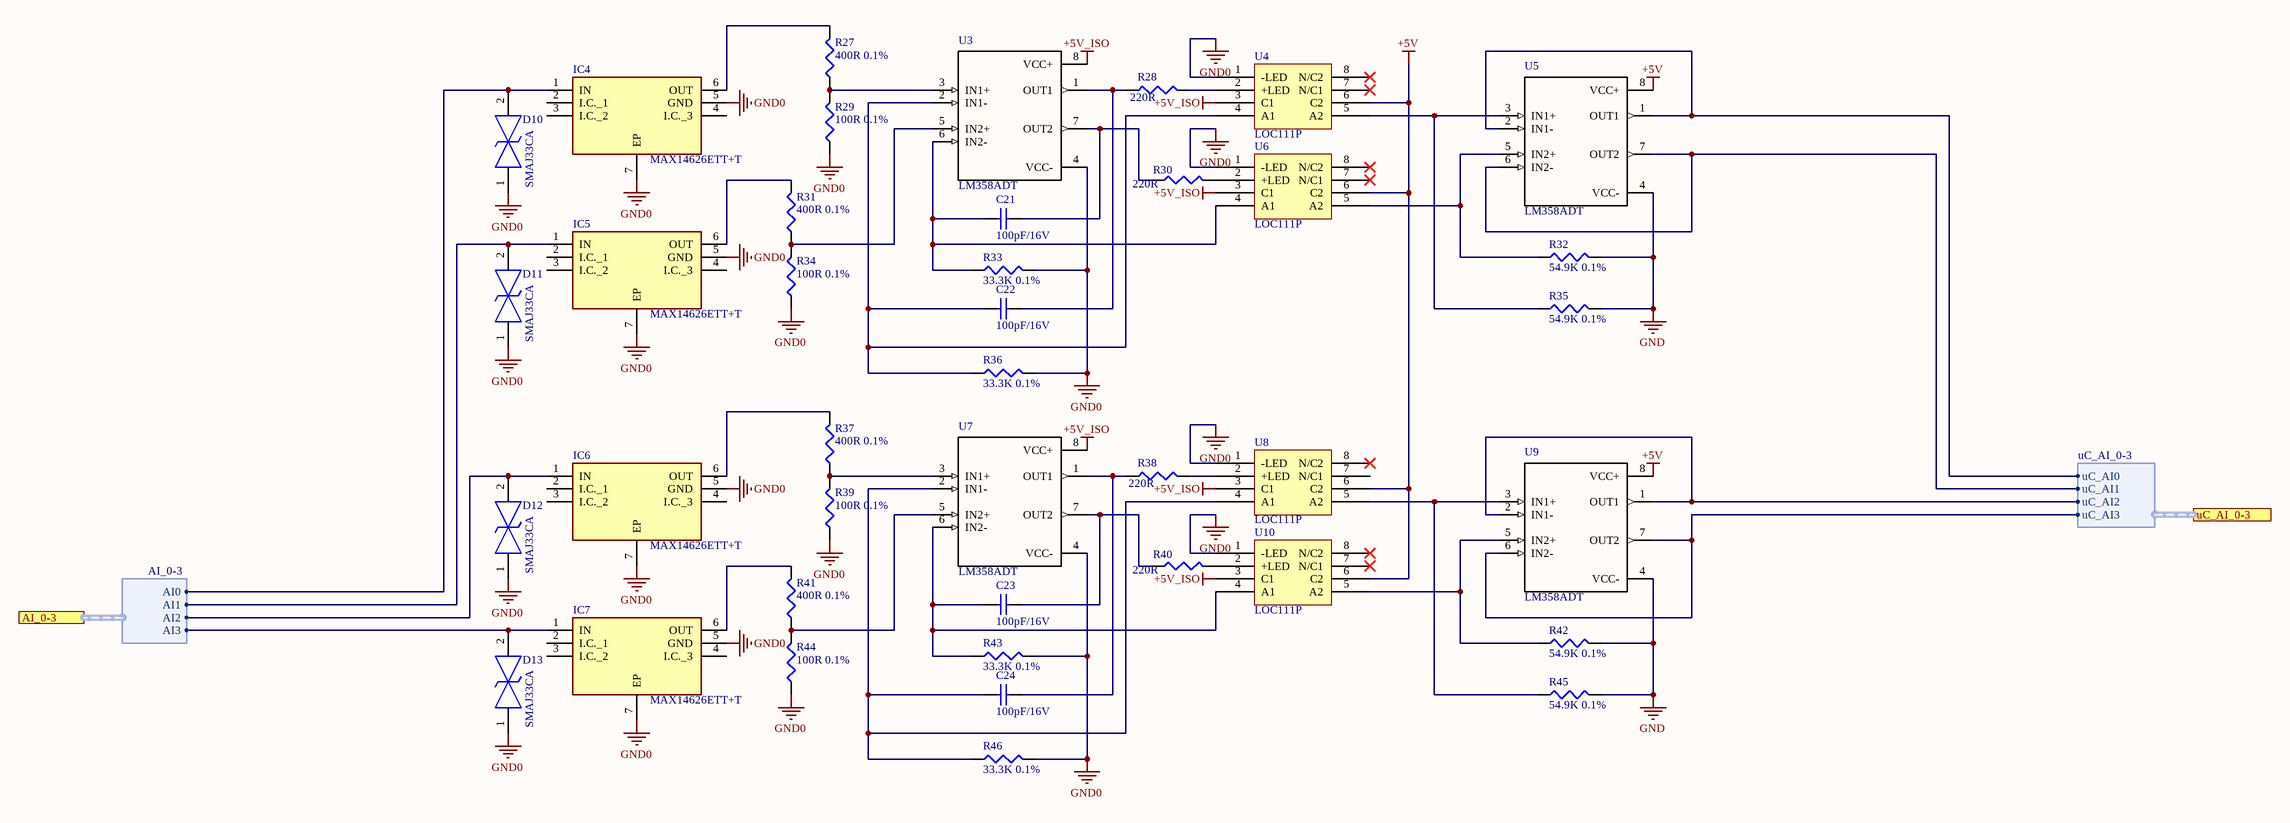
[diagram p3: ANALOG_INPUT.SchDoc]

### Parts
C21  100pF/16V  [1608[0603]]
C22  100pF/16V  [1608[0603]]
C23  100pF/16V  [1608[0603]]
C24  100pF/16V  [1608[0603]]
D10  SMAJ33CA  [DIONM5126X250N]
D11  SMAJ33CA  [DIONM5126X250N]
D12  SMAJ33CA  [DIONM5126X250N]
D13  SMAJ33CA  [DIONM5126X250N]
IC4  MAX14626ETT+T  [SON95P300X300X80-7N]
IC5  MAX14626ETT+T  [SON95P300X300X80-7N]
IC6  MAX14626ETT+T  [SON95P300X300X80-7N]
IC7  MAX14626ETT+T  [SON95P300X300X80-7N]
R27  400R 0.1%  [C1206]
R28  220R  [J1-0603]
R29  100R 0.1%  [C1206]
R30  220R  [J1-0603]
R31  400R 0.1%  [C1206]
R32  54.9K 0.1%  [J1-0603]
R33  33.3K 0.1%  [J1-0603]
R34  100R 0.1%  [C1206]
R35  54.9K 0.1%  [J1-0603]
R36  33.3K 0.1%  [J1-0603]
R37  400R 0.1%  [C1206]
R38  220R  [J1-0603]
R39  100R 0.1%  [C1206]
R40  220R  [J1-0603]
R41  400R 0.1%  [C1206]
R42  54.9K 0.1%  [J1-0603]
R43  33.3K 0.1%  [J1-0603]
R44  100R 0.1%  [C1206]
R45  54.9K 0.1%  [J1-0603]
R46  33.3K 0.1%  [J1-0603]
U3  LM358ADT  [*SOIC127P600X175-8N]
U4  LOC111P  [SOP254P940X265-8N]
U5  LM358ADT  [*SOIC127P600X175-8N]
U6  LOC111P  [SOP254P940X265-8N]
U7  LM358ADT  [*SOIC127P600X175-8N]
U8  LOC111P  [SOP254P940X265-8N]
U9  LM358ADT  [*SOIC127P600X175-8N]
U10  LOC111P  [SOP254P940X265-8N]

### Ports
AI_0-3 (harness AI_0-3), uC_AI_0-3 (harness uC_AI_0-3)

### Harnesses
uC_AI_0-3: uC_AI0, uC_AI1, uC_AI2, uC_AI3
AI_0-3: AI0, AI1, AI2, AI3

### Nets
+5V: U4.6(C2) U5.8(VCC+) U6.6(C2) U8.6(C2) U9.8(VCC+) U10.6(C2)
+5V_ISO: U3.8(VCC+) U4.3(C1) U6.3(C1) U7.8(VCC+) U8.3(C1) U10.3(C1)
GND: R32.2 R35.2 R42.2 R45.2 U5.4(VCC-) U9.4(VCC-)
GND0: D10.1 D11.1 D12.1 D13.1 IC4.5(GND) IC4.7(EP) IC5.5(GND) IC5.7(EP) IC6.5(GND) IC6.7(EP) IC7.5(GND) IC7.7(EP) R29.1 R33.2 R34.1 R36.2 R39.1 R43.2 R44.1 R46.2 U3.4(VCC-) U4.1(-LED) U6.1(-LED) U7.4(VCC-) U8.1(-LED) U10.1(-LED)
uC_AI0: U5.1(OUT1) U5.2(IN1-) ; port uC_AI_0-3.uC_AI0
uC_AI1: U5.6(IN2-) U5.7(OUT2) ; port uC_AI_0-3.uC_AI1
uC_AI2: U9.1(OUT1) U9.2(IN1-) ; port uC_AI_0-3.uC_AI2
uC_AI3: U9.6(IN2-) U9.7(OUT2) ; port uC_AI_0-3.uC_AI3
NetC21_1: C21.1 R33.1 U3.6(IN2-) U6.4(A1)
NetC21_2: C21.2 R30.1 U3.7(OUT2)
NetC22_1: C22.1 R36.1 U3.2(IN1-) U4.4(A1)
NetC22_2: C22.2 R28.1 U3.1(OUT1)
NetC23_1: C23.1 R43.1 U7.6(IN2-) U10.4(A1)
NetC23_2: C23.2 R40.1 U7.7(OUT2)
NetC24_1: C24.1 R46.1 U7.2(IN1-) U8.4(A1)
NetC24_2: C24.2 R38.1 U7.1(OUT1)
NetD10_2: D10.2 IC4.1(IN) ; port AI_0-3.AI0
NetD11_2: D11.2 IC5.1(IN) ; port AI_0-3.AI1
NetD12_2: D12.2 IC6.1(IN) ; port AI_0-3.AI2
NetD13_2: D13.2 IC7.1(IN) ; port AI_0-3.AI3
NetIC4_6: IC4.6(OUT) R27.2
NetIC5_6: IC5.6(OUT) R31.2
NetIC6_6: IC6.6(OUT) R37.2
NetIC7_6: IC7.6(OUT) R41.2
NetR27_1: R27.1 R29.2 U3.3(IN1+)
NetR28_2: R28.2 U4.2(+LED)
NetR30_2: R30.2 U6.2(+LED)
NetR31_1: R31.1 R34.2 U3.5(IN2+)
NetR32_1: R32.1 U5.5(IN2+) U6.5(A2)
NetR35_1: R35.1 U4.5(A2) U5.3(IN1+)
NetR37_1: R37.1 R39.2 U7.3(IN1+)
NetR38_2: R38.2 U8.2(+LED)
NetR40_2: R40.2 U10.2(+LED)
NetR41_1: R41.1 R44.2 U7.5(IN2+)
NetR42_1: R42.1 U9.5(IN2+) U10.5(A2)
NetR45_1: R45.1 U8.5(A2) U9.3(IN1+)

Not connected (* = marked no-connect by the designer): IC4 2(I.C._1) 3(I.C._2) 4(I.C._3); IC5 2(I.C._1) 3(I.C._2) 4(I.C._3); IC6 2(I.C._1) 3(I.C._2) 4(I.C._3); IC7 2(I.C._1) 3(I.C._2) 4(I.C._3); U4 7(N/C1)* 8(N/C2)*; U6 7(N/C1)* 8(N/C2)*; U8 7(N/C1) 8(N/C2)*; U10 7(N/C1)* 8(N/C2)*

### Library data of the parts
C21-C24 = Cap Semi: Capacitor (Semiconductor SIM Model); Published: 8-Jun-2000; LatestRevisionDate: 29-May-2009; LatestRevisionNote: IPC-7351 Footprint Added.; PackageReference: C1206; Publisher: Altium Limited; PackageDescription: Chip Capacitor; Value: 100pF/16V
D10-D13 = SMAJ33CA: TVS Diode (Bi-directional); Manufacturer_Name: LITTELFUSE; Datasheet Link: https://componentsearchengine.com/Datasheets/2/SMAJ33CA.pdf; Height: 2.5mm; Manufacturer_Part_Number: SMAJ33CA; Mouser Part Number: 576-SMAJ33CA; Mouser Price/Stock: https://www.mouser.co.uk/ProductDetail/Littelfuse/SMAJ33CA?qs=JJML70Qc14tynAcWzvnSpg%3D%3D; Arrow Part Number: SMAJ33CA; Arrow Price/Stock: https://www.arrow.com/en/products/smaj33ca/littelfuse?region=nac
IC4-IC7 = MAX14626ETT+T: Integrated Circuit; Manufacturer_Name: Maxim Integrated; Datasheet Link: http://datasheets.maximintegrated.com/en/ds/MAX14626.pdf; Height: 0.8mm; Manufacturer_Part_Number: MAX14626ETT+T; Mouser Part Number: 700-MAX14626ETT+T; Mouser Price/Stock: https://www.mouser.co.uk/ProductDetail/Maxim-Integrated/MAX14626ETT%2bT?qs=Vwh6e7toGLjhMUByPdHdJg%3D%3D
R27 R29 R31 R34 R37 R39 R41 R44 = Res3: Resistor; Value: 500R; Published: 8-Jun-2000; LatestRevisionDate: 29-May-2009; LatestRevisionNote: IPC-7351 Footprint Added.; PackageReference: J1-0603; Publisher: Altium Limited; PackageDescription: Chip Resistor
R28 R30 R38 R40 = Res3: Resistor; Published: 8-Jun-2000; LatestRevisionDate: 29-May-2009; LatestRevisionNote: IPC-7351 Footprint Added.; PackageReference: J1-0603; Publisher: Altium Limited; PackageDescription: Chip Resistor; Value: 220R
R32 R35 R42 R45 = Res3: Resistor; Value: 55K; Published: 8-Jun-2000; LatestRevisionDate: 29-May-2009; LatestRevisionNote: IPC-7351 Footprint Added.; PackageReference: J1-0603; Publisher: Altium Limited; PackageDescription: Chip Resistor
R33 R36 R43 R46 = Res3: Resistor; Value: 167K; Published: 8-Jun-2000; LatestRevisionDate: 29-May-2009; LatestRevisionNote: IPC-7351 Footprint Added.; PackageReference: J1-0603; Publisher: Altium Limited; PackageDescription: Chip Resistor
U3 U5 U7 U9 = LM358ADT: LM358 Series 30 V 1.1 MHz Low Power Dual Operational Amplifier - SOIC-8; MF: STMicroelectronics; SnapEDA_Link: https://www.snapeda.com/parts/LM358ADT/STMicroelectronics/view-part/?ref=snap; MP: LM358ADT; Availability: Unavailable; Price: None; Package: SOIC-8 STMicroelectronics; Value: *
U4 U6 U8 U10 = LOC111P: Linear Optocoupler

## Sheet DIGITAL_OUTPUT.SchDoc
size A
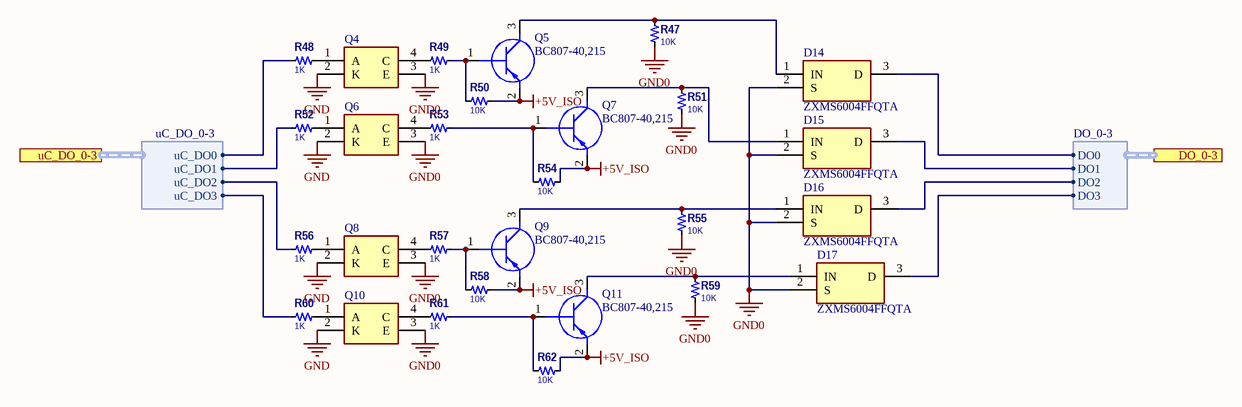
[diagram p4: DIGITAL_OUTPUT.SchDoc]

### Parts
D14  ZXMS6004FFQTA  [SOTFL95P240X100-3N]
D15  ZXMS6004FFQTA  [SOTFL95P240X100-3N]
D16  ZXMS6004FFQTA  [SOTFL95P240X100-3N]
D17  ZXMS6004FFQTA  [SOTFL95P240X100-3N]
Q4  TLX9291A_GBTPL,F  [SOIC127P700X230-4N]  (value not drawn)
Q5  BC807-40,215  [SOT95P230X110-3N]
Q6  TLX9291A_GBTPL,F  [SOIC127P700X230-4N]  (value not drawn)
Q7  BC807-40,215  [SOT95P230X110-3N]
Q8  TLX9291A_GBTPL,F  [SOIC127P700X230-4N]  (value not drawn)
Q9  BC807-40,215  [SOT95P230X110-3N]
Q10  TLX9291A_GBTPL,F  [SOIC127P700X230-4N]  (value not drawn)
Q11  BC807-40,215  [SOT95P230X110-3N]
R47  10K  [0603-R]
R48  1K  [0603-R]
R49  1K  [0603-R]
R50  10K  [0603-R]
R51  10K  [0603-R]
R52  1K  [0603-R]
R53  1K  [0603-R]
R54  10K  [0603-R]
R55  10K  [0603-R]
R56  1K  [0603-R]
R57  1K  [0603-R]
R58  10K  [0603-R]
R59  10K  [0603-R]
R60  1K  [0603-R]
R61  1K  [0603-R]
R62  10K  [0603-R]

### Ports
DO_0-3 (harness DO_0-3), uC_DO_0-3 (harness uC_DO_0-3)

### Harnesses
DO_0-3: DO0, DO1, DO2, DO3
uC_DO_0-3: uC_DO0, uC_DO1, uC_DO2, uC_DO3

### Nets
+5V_ISO: Q5.2(E) Q7.2(E) Q9.2(E) Q11.2(E) R50.2 R54.2 R58.2 R62.2
GND: Q4.2(K) Q6.2(K) Q8.2(K) Q10.2(K)
GND0: D14.2(S) D15.2(S) D16.2(S) D17.2(S) Q4.3(E) Q6.3(E) Q8.3(E) Q10.3(E) R47.1 R51.1 R55.1 R59.1
uC_DO0: R48.1 ; port uC_DO_0-3.uC_DO0
uC_DO1: R52.1 ; port uC_DO_0-3.uC_DO1
uC_DO2: R56.1 ; port uC_DO_0-3.uC_DO2
uC_DO3: R60.1 ; port uC_DO_0-3.uC_DO3
NetD14_1: D14.1(IN) Q5.3(C) R47.2
NetD14_3: D14.3(D) ; port DO_0-3.DO0
NetD15_1: D15.1(IN) Q7.3(C) R51.2
NetD15_3: D15.3(D) ; port DO_0-3.DO1
NetD16_1: D16.1(IN) Q9.3(C) R55.2
NetD16_3: D16.3(D) ; port DO_0-3.DO2
NetD17_1: D17.1(IN) Q11.3(C) R59.2
NetD17_3: D17.3(D) ; port DO_0-3.DO3
NetQ4_1: Q4.1(A) R48.2
NetQ4_4: Q4.4(C) R49.1
NetQ5_1: Q5.1(B) R49.2 R50.1
NetQ6_1: Q6.1(A) R52.2
NetQ6_4: Q6.4(C) R53.1
NetQ7_1: Q7.1(B) R53.2 R54.1
NetQ8_1: Q8.1(A) R56.2
NetQ8_4: Q8.4(C) R57.1
NetQ9_1: Q9.1(B) R57.2 R58.1
NetQ10_1: Q10.1(A) R60.2
NetQ10_4: Q10.4(C) R61.1
NetQ11_1: Q11.1(B) R61.2 R62.1

### Library data of the parts
D14-D17 = ZXMS6004FFQTA: Diode; Manufacturer_Name: Diodes Inc.; Datasheet Link: https://www.diodes.com/assets/Datasheets/ZXMS6004FFQ.pdf; Height: 1mm; Manufacturer_Part_Number: ZXMS6004FFQTA; Mouser Part Number: 621-ZXMS6004FFQTA; Mouser Price/Stock: https://www.mouser.co.uk/ProductDetail/Diodes-Incorporated/ZXMS6004FFQTA?qs=nVS1qgv%252BQrk3b3Yw041IKA%3D%3D; Arrow Part Number: ZXMS6004FFQTA; Arrow Price/Stock: https://www.arrow.com/en/products/zxms6004ffqta/diodes-incorporated?region=nac
Q4 Q6 Q8 Q10 = TLX9291A_GBTPL,F: Phototransistor; Manufacturer_Name: Toshiba; Manufacturer_Part_Number: TLX9291A(GBTPL,F; Datasheet Link: https://toshiba.semicon-storage.com/info/docget.jsp?did=53137&prodName=TLX9291A; Height: 2.3mm; Mouser Part Number: 757-TLX9291AGBTPLF; Mouser Price/Stock: https://www.mouser.co.uk/ProductDetail/Toshiba/TLX9291AGBTPLF?qs=YwPsRIUVAOcOvZScDNZO1w%3D%3D
Q5 Q7 Q9 Q11 = BC807-40,215: Transistor BJT PNP; Manufacturer_Name: Nexperia; Datasheet Link: https://assets.nexperia.com/documents/data-sheet/BC807_SER.pdf; Height: 1.1mm; Manufacturer_Part_Number: BC807-40,215; Mouser Part Number: 771-BC807-40-T/R; Mouser Price/Stock: https://www.mouser.co.uk/ProductDetail/Nexperia/BC807-40215?qs=me8TqzrmIYUR795aoYEBCw%3D%3D; Arrow Part Number: BC807-40,215; Arrow Price/Stock: https://www.arrow.com/en/products/bc807-40215/nexperia?region=europe
R47-R62 = Res_2: as R1 on sheet Power_management; ComponentLink1URL: https://datasheet.ciiva.com/15193/getdatasheetpartid-366470-15193725.pdf?src-supplier=Verical; ComponentLink1Description: Datasheet; Supplier 1: Avnet; Stock 1: 6255; Pricing 1: 1 = 0.01200 (USD); RoHS: Yes; Mount: Surface Mount; Case Code (Metric): 3216; Case Code (Imperial): 1206; Contact Plating: Tin; Min Operating Temperature: -55°C; Max Operating Temperature: 155°C; Packaging: Tape and Reel; Package Quantity: 1; Resistor Type: Thick Film; Number of Terminations: 2; Voltage Rating (DC): 200V; Features: Automotive AEC-Q200; Series: ERJ; Construction: Rectangular; Resistance Tolerance: 5%; Length: 3.2mm; Width: 0.063inch; Height: 0.028inch; Depth: 1.6mm; Radiation Hardening: No; REACH SVHC: No SVHC; Military Standard: Not; Lead Free: Lead Free; RoHS Compliant: Yes; ComponentLink2URL: https://datasheet.ciiva.com/46387/1500035-46387094.pdf?src-supplier=Element14; ComponentLink2Description: https://datasheet.ciiva.com/46387/1500035-46387094.pdf?src-supplier=Element14; ComponentLink3URL: https://datasheet.ciiva.com/5915/1500035-5915369.pdf?src-supplier=Farnell; ComponentLink3Description: https://datasheet.ciiva.com/5915/1500035-5915369.pdf?src-supplier=Farnell; ComponentLink4URL: https://datasheet.ciiva.com/28677/1678796-28677018.pdf?src-supplier=Element14; ComponentLink4Description: https://datasheet.ciiva.com/28677/1678796-28677018.pdf?src-supplier=Element14; ComponentLink5URL: https://datasheet.ciiva.com/17204/aoa0000ce1-17204972.pdf?src-supplier=Avnet+Europe; ComponentLink5Description: https://datasheet.ciiva.com/17204/aoa0000ce1-17204972.pdf?src-supplier=Avnet+Europe; ComponentLink6URL: https://datasheet.ciiva.com/16515/aoa0000ce1-16515933.pdf?src-supplier=Avnet+Asia; ComponentLink6Description: https://datasheet.ciiva.com/16515/aoa0000ce1-16515933.pdf?src-supplier=Avnet+Asia; Supplier Part Number 1: 65T8955; Power Rating: 250mW; Case/Package: 0603

## Sheet RFID.SchDoc
size A
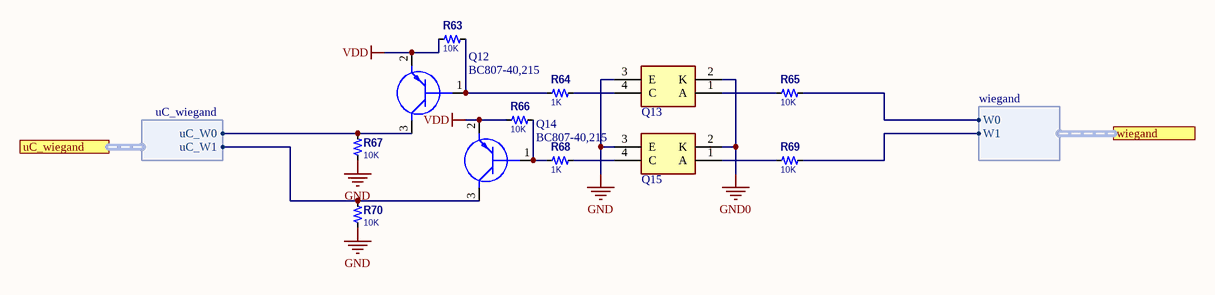
[diagram p5: RFID.SchDoc]

### Parts
Q12  BC807-40,215  [SOT95P230X110-3N]
Q13  TLX9291A_GBTPL,F  [SOIC127P700X230-4N]  (value not drawn)
Q14  BC807-40,215  [SOT95P230X110-3N]
Q15  TLX9291A_GBTPL,F  [SOIC127P700X230-4N]  (value not drawn)
R63  10K  [0603-R]
R64  1K  [0603-R]
R65  10K  [0603-R]
R66  10K  [0603-R]
R67  10K  [0603-R]
R68  1K  [0603-R]
R69  10K  [0603-R]
R70  10K  [0603-R]

### Ports
uC_wiegand (harness uC_wiegand), wiegand (harness wiegand)

### Harnesses
uC_wiegand: uC_W0, uC_W1
wiegand: W0, W1

### Nets
GND: Q13.3(E) Q15.3(E) R67.2 R70.2
GND0: Q13.2(K) Q15.2(K)
VDD: Q12.2(E) Q14.2(E) R63.2 R66.2  [project net 3.3V_MCU]
W0: Q12.3(C) R67.1 ; port uC_wiegand.uC_W0
W1: Q14.3(C) R70.1 ; port uC_wiegand.uC_W1
NetQ12_1: Q12.1(B) R63.1 R64.2
NetQ13_1: Q13.1(A) R65.2
NetQ13_4: Q13.4(C) R64.1
NetQ14_1: Q14.1(B) R66.1 R68.2
NetQ15_1: Q15.1(A) R69.2
NetQ15_4: Q15.4(C) R68.1
NetR65_1: R65.1 ; port wiegand.W0
NetR69_1: R69.1 ; port wiegand.W1

### Library data of the parts
Q12 Q14 = BC807-40,215: as Q5 on sheet DIGITAL_OUTPUT; Datasheet Link: https://assets.nexperia.com/documents/data-sheet/BC807_SER.pdf; Height: 1.1mm; Manufacturer_Part_Number: BC807-40,215; Mouser Part Number: 771-BC807-40-T/R; Mouser Price/Stock: https://www.mouser.co.uk/ProductDetail/Nexperia/BC807-40215?qs=me8TqzrmIYUR795aoYEBCw%3D%3D; Arrow Part Number: BC807-40,215; Arrow Price/Stock: https://www.arrow.com/en/products/bc807-40215/nexperia?region=europe
Q13 Q15 = TLX9291A_GBTPL,F: as Q4 on sheet DIGITAL_OUTPUT; Datasheet Link: https://toshiba.semicon-storage.com/info/docget.jsp?did=53137&prodName=TLX9291A; Height: 2.3mm; Mouser Part Number: 757-TLX9291AGBTPLF; Mouser Price/Stock: https://www.mouser.co.uk/ProductDetail/Toshiba/TLX9291AGBTPLF?qs=YwPsRIUVAOcOvZScDNZO1w%3D%3D
R63-R70 = Res_2: as R1 on sheet Power_management; ComponentLink1URL: https://datasheet.ciiva.com/15193/getdatasheetpartid-366470-15193725.pdf?src-supplier=Verical; ComponentLink1Description: Datasheet; Supplier 1: Avnet; Stock 1: 6255; Pricing 1: 1 = 0.01200 (USD); RoHS: Yes; Mount: Surface Mount; Case Code (Metric): 3216; Case Code (Imperial): 1206; Contact Plating: Tin; Min Operating Temperature: -55°C; Max Operating Temperature: 155°C; Packaging: Tape and Reel; Package Quantity: 1; Resistor Type: Thick Film; Number of Terminations: 2; Voltage Rating (DC): 200V; Features: Automotive AEC-Q200; Series: ERJ; Construction: Rectangular; Resistance Tolerance: 5%; Length: 3.2mm; Width: 0.063inch; Height: 0.028inch; Depth: 1.6mm; Radiation Hardening: No; REACH SVHC: No SVHC; Military Standard: Not; Lead Free: Lead Free; RoHS Compliant: Yes; ComponentLink2URL: https://datasheet.ciiva.com/46387/1500035-46387094.pdf?src-supplier=Element14; ComponentLink2Description: https://datasheet.ciiva.com/46387/1500035-46387094.pdf?src-supplier=Element14; ComponentLink3URL: https://datasheet.ciiva.com/5915/1500035-5915369.pdf?src-supplier=Farnell; ComponentLink3Description: https://datasheet.ciiva.com/5915/1500035-5915369.pdf?src-supplier=Farnell; ComponentLink4URL: https://datasheet.ciiva.com/28677/1678796-28677018.pdf?src-supplier=Element14; ComponentLink4Description: https://datasheet.ciiva.com/28677/1678796-28677018.pdf?src-supplier=Element14; ComponentLink5URL: https://datasheet.ciiva.com/17204/aoa0000ce1-17204972.pdf?src-supplier=Avnet+Europe; ComponentLink5Description: https://datasheet.ciiva.com/17204/aoa0000ce1-17204972.pdf?src-supplier=Avnet+Europe; ComponentLink6URL: https://datasheet.ciiva.com/16515/aoa0000ce1-16515933.pdf?src-supplier=Avnet+Asia; ComponentLink6Description: https://datasheet.ciiva.com/16515/aoa0000ce1-16515933.pdf?src-supplier=Avnet+Asia; Supplier Part Number 1: 65T8955; Power Rating: 250mW; Case/Package: 0603

## Nets that join several sheets
3.3V_MCU: MCU (5 pins), DIGITAL_INPUT (IC3.16), RFID (Q12.2 Q14.2 R63.2 R66.2)
+5V_ISO: ANALOG_INPUT (6 pins), DIGITAL_OUTPUT (8 pins)
GND: Power_management (7 pins), MCU (35 pins), DIGITAL_INPUT (IC3.15), ANALOG_INPUT (6 pins), DIGITAL_OUTPUT (Q4.2 Q6.2 Q8.2 Q10.2), RFID (Q13.3 Q15.3 R67.2 R70.2)
GND0: Power_management (5 pins), DIGITAL_INPUT (26 pins), ANALOG_INPUT (26 pins), DIGITAL_OUTPUT (12 pins), RFID (Q13.2 Q15.2)
uC_AI0: MCU (U2.4), ANALOG_INPUT (U5.1 U5.2)
uC_AI1: MCU (U2.5), ANALOG_INPUT (U5.6 U5.7)
uC_AI2: MCU (U2.6), ANALOG_INPUT (U9.1 U9.2)
uC_AI3: MCU (U2.7), ANALOG_INPUT (U9.6 U9.7)
uC_DI0: MCU (U2.8), DIGITAL_INPUT (IC3.20)
uC_DI1: MCU (U2.9), DIGITAL_INPUT (IC3.19)
uC_DI2: MCU (U2.10), DIGITAL_INPUT (IC3.18)
uC_DI3: MCU (U2.11), DIGITAL_INPUT (IC3.17)
uC_DI4: MCU (U2.12), DIGITAL_INPUT (IC3.14)
uC_DI5: MCU (U2.13), DIGITAL_INPUT (IC3.13)
uC_DI6: MCU (U2.14), DIGITAL_INPUT (IC3.12)
uC_DI7: MCU (U2.16), DIGITAL_INPUT (IC3.11)
uC_DO0: MCU (U2.27), DIGITAL_OUTPUT (R48.1)
uC_DO1: MCU (U2.28), DIGITAL_OUTPUT (R52.1)
uC_DO2: MCU (U2.29), DIGITAL_OUTPUT (R56.1)
uC_DO3: MCU (U2.30), DIGITAL_OUTPUT (R60.1)
W0: MCU (U2.23), RFID (Q12.3 R67.1)
W1: MCU (U2.24), RFID (Q14.3 R70.1)